# EAGLE design DS18B20_with_DS2480B_MAX233_V3 (EAGLE 7.5.0)
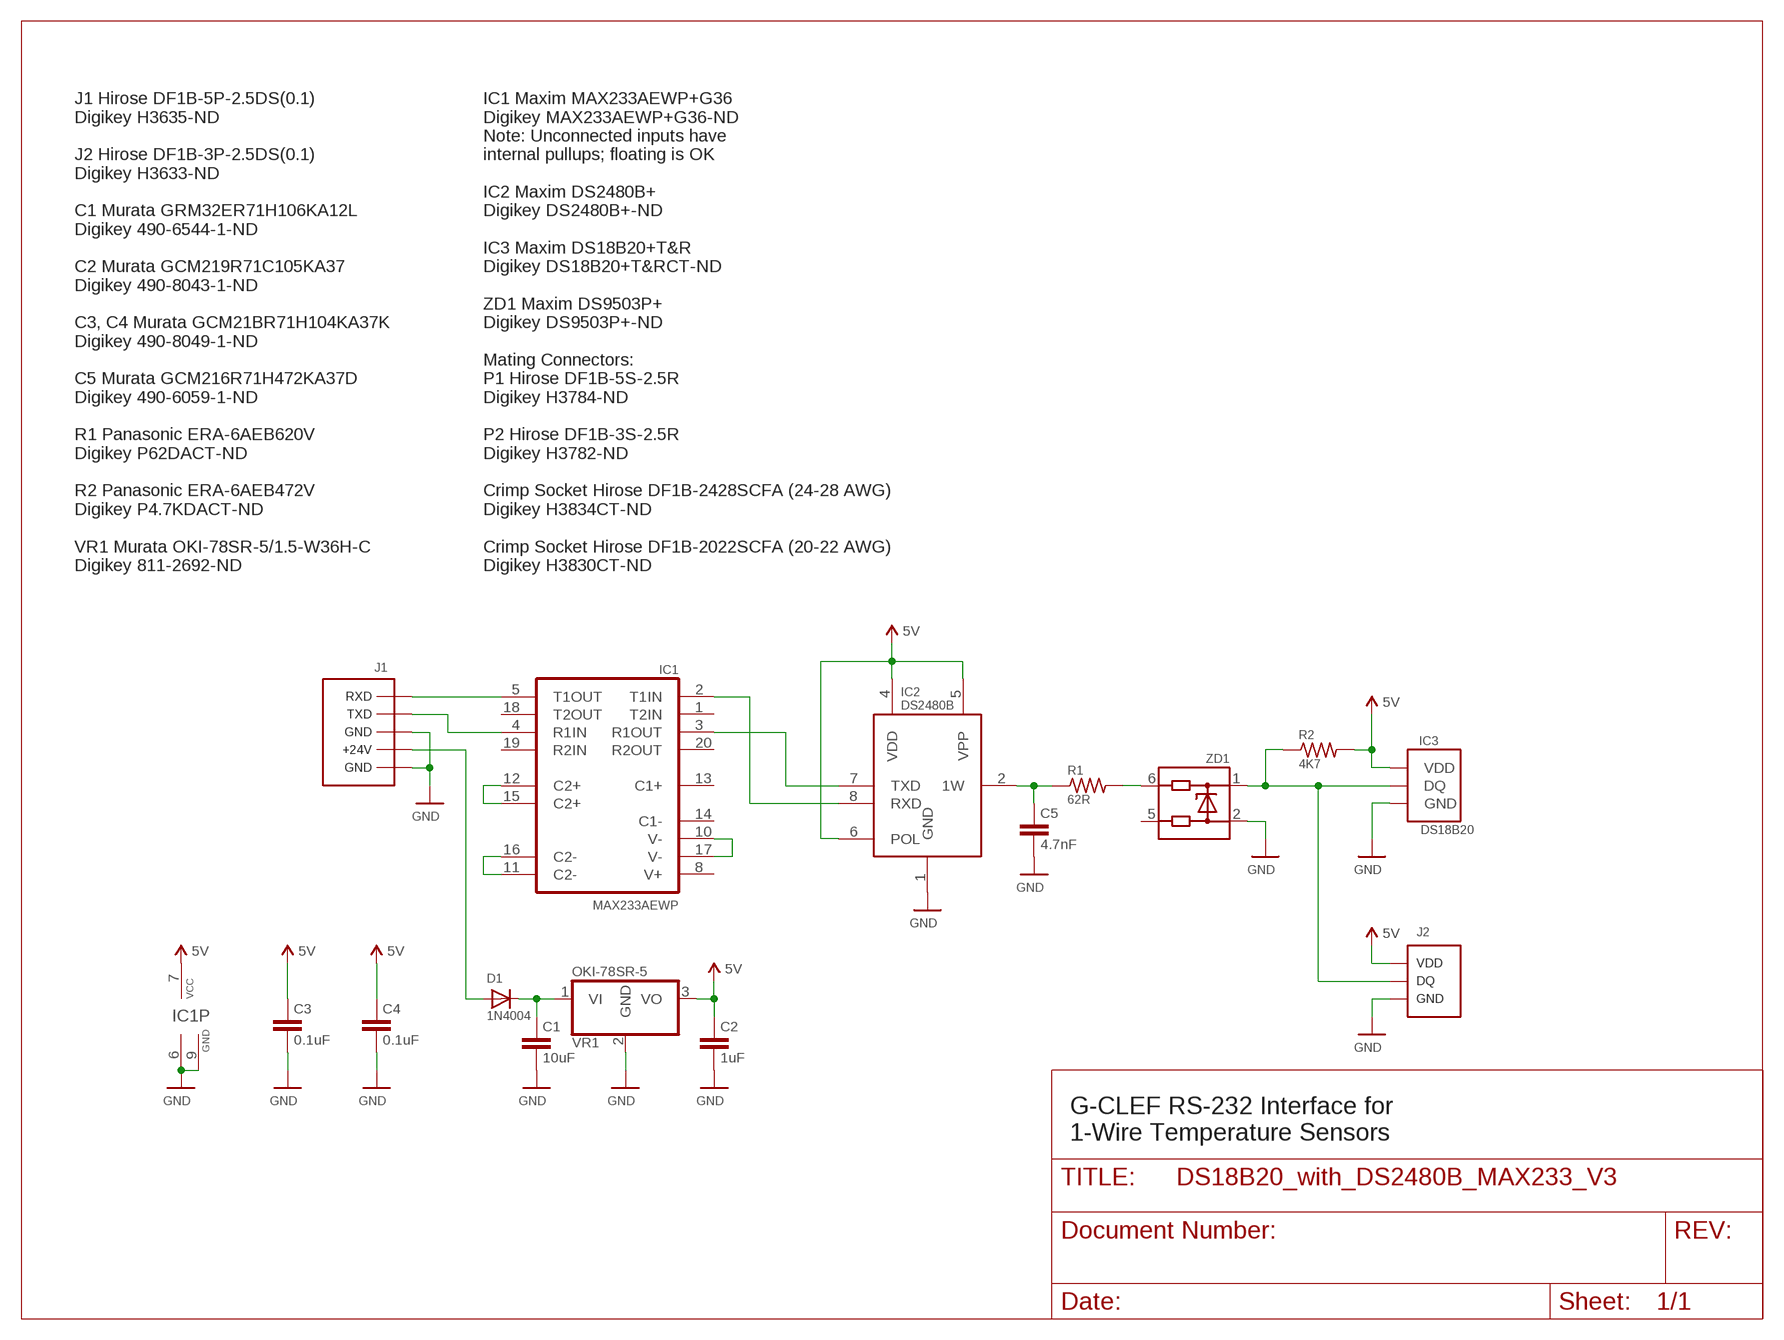
[diagram p0: schematic, sheet 1]

## Parts
C1  10uF  C-UNPOL1210-CAP  [CAPC3225X270N]
C2  1uF  C-UNPOL0805-CAP  [CAPC2013X135N]
C3  0.1uF  C-UNPOL0805-CAP  [CAPC2013X135N]
C4  0.1uF  C-UNPOL0805-CAP  [CAPC2013X135N]
C5  4.7nF  C-UNPOL0805-CAP  [CAPC2013X135N]
D1  1N4004  [DO41-10]
IC1  MAX233AEWP  [SO20L]
IC2  DS2480B  [SO08]
IC3  DS18B20  [TO92-]
J1  DF1B-5P  [DF1B-5P]
J2  DF1B-3P  [DF1B-3P]
R1  62R  RESISTOR-0805  [RESISTOR-0805]
R2  4K7  RESISTOR-0805  [RESISTOR-0805]
VR1  OKI-78SR-5  OKI-78SRH  [OKI-78SR]
ZD1  DS9503P  [TSOC6+]

## Nets
5V: C2.1 C3.1 C4.1 IC1.7(VCC) IC2.4(VDD) IC2.5(VPP) IC2.6(POL) IC3.3(VDD) J2.P$3 R2.2 VR1.3(VO)
GND: C1.2 C2.2 C3.2 C4.2 C5.2 IC1.6(GND) IC1.9(GND) IC2.1(GND) IC3.1(GND) J1.P$1 J1.P$3 J2.P$1 VR1.2(GND) ZD1.2
N$1: D1.A J1.P$2
N$2: C1.1 D1.C VR1.1(VI)
N$3: IC1.2(T1IN) IC2.8(RXD)
N$4: IC1.5(T1OUT) J1.P$5
N$5: IC1.4(R1IN) J1.P$4
N$7: IC1.12(C2+) IC1.15(C2+)
N$8: IC1.11(C2-) IC1.16(C2-)
N$9: IC1.10(V-) IC1.17(V-)
N$10: IC1.3(R1OUT) IC2.7(TXD)
N$11: C5.1 IC2.2(1W) R1.1
N$13: R1.2 ZD1.6
N$14: IC3.2(DQ) J2.P$2 R2.1 ZD1.1
Unconnected: IC1.1(T2IN) IC1.8(V+) IC1.13(C1+) IC1.14(C1-) IC1.18(T2OUT) IC1.19(R2IN) IC1.20(R2OUT) ZD1.5

## Notes on the sheet
- J1 Hirose DF1B-5P-2.5DS(0.1)
  Digikey H3635-ND
  
  J2 Hirose DF1B-3P-2.5DS(0.1)
  Digikey H3633-ND
  
  C1 Murata GRM32ER71H106KA12L
  Digikey 490-6544-1-ND
  
  C2 Murata GCM219R71C105KA37
  Digikey 490-8043-1-ND
  
  C3, C4 Murata GCM21BR71H104KA37K
  Digikey 490-8049-1-ND
  
  C5 Murata GCM216R71H472KA37D
  Digikey 490-6059-1-ND
  
  R1 Panasonic ERA-6AEB620V
  Digikey P62DACT-ND
  
  R2 Panasonic ERA-6AEB472V
  Digikey P4.7KDACT-ND
  
  VR1 Murata OKI-78SR-5/1.5-W36H-C
  Digikey 811-2692-ND
- IC1 Maxim MAX233AEWP+G36
  Digikey MAX233AEWP+G36-ND
  Note: Unconnected inputs have
  internal pullups; floating is OK
  
  IC2 Maxim DS2480B+
  Digikey DS2480B+-ND
  
  IC3 Maxim DS18B20+T&R
  Digikey DS18B20+T&RCT-ND
  
  ZD1 Maxim DS9503P+
  Digikey DS9503P+-ND
  
  Mating Connectors:
  P1 Hirose DF1B-5S-2.5R
  Digikey H3784-ND
  
  P2 Hirose DF1B-3S-2.5R
  Digikey H3782-ND
  
  Crimp Socket Hirose DF1B-2428SCFA (24-28 AWG)
  Digikey H3834CT-ND
  
  Crimp Socket Hirose DF1B-2022SCFA (20-22 AWG)
  Digikey H3830CT-ND
- RXD
- TXD
- GND
- +24V
- GND
- VDD
- DQ
- GND
- G-CLEF RS-232 Interface for
  1-Wire Temperature Sensors

## Library data of the parts
C1-C5 = AU2016:C-UNPOL
D1 = AU2016:1N4004: DIODE General purpose 1N400x type rectifier (With bigger pads) http://www.ladyada.net/library/pcb/eaglelibrary.html
IC1 = AU2016:MAX233AEWP: RS232 TRANSCEIVER; MPN: MAX233AEWP+G36; OC_FARNELL: unknown; OC_NEWARK: 89K3461
IC2 = AU2016:DS2480B: RS232 to 1-Wire Host Adapter/Line Driver with Load Sensor This device is a onewire host and UART interface in one chip. It provides the complete DC/AC requirements for onewire communication, including overdrive speed mode and 12V EPROM programming. On the UART side, it can operate at 9.6kBaud (default), 19.2kBaud, 57.6kBaud, and 115.2kBaud. The RxD and TxD lines are operated at 0V/5V. The POL pin selects the RxD and TxD "polarity", that means straight-through or inverted. If POL is connected to GND, RxD and TxD behave properly for connection to inverted RS232 drivers, like the MC1488/1489 or MAX23x chips. If POL is connected to Vdd, RxD and TxD behave properly for direct connection to a 0V/5V UART chip. Important Notes: RxD and TxD are seen from the UART point of view, that means the DS2480B TxD pin is really an input and the DS2480B RxD pin is really an output. Vpp must be connected to 5V/Vdd if EPROM programming is not required. Vdd must be always lower than or equal to Vpp, otherwise the chip will be damaged. Best idea is to provide a separate 12V->5V/5mA voltage regulator from Vpp to Vdd if EPROM programming is required. Author: Jan Kandziora <jjj@gmx.de>
IC3 = AU2016:DS18B20
J1 = AU2016:DF1B-5P
J2 = AU2016:DF1B-3P
R1 R2 = AU2016:RESISTOR-0805
VR1 = AU2016:OKI-78SR
ZD1 = AU2016:DS9503: ESD Protection Diode with Resistors This ESD protection diode is designed especially for onewire host interfaces. Unlike the DS9502, it has two additional 5Ohm resitors in the 1W and GND line. Pin 5 and 6 have to be connected to the host side, pin 1 und 2 to the network side. The 1W line is through pin 1 and 6, the GND line is through pin 2 and 5. Author: Jan Kandziora <jjj@gmx.de>

## Board
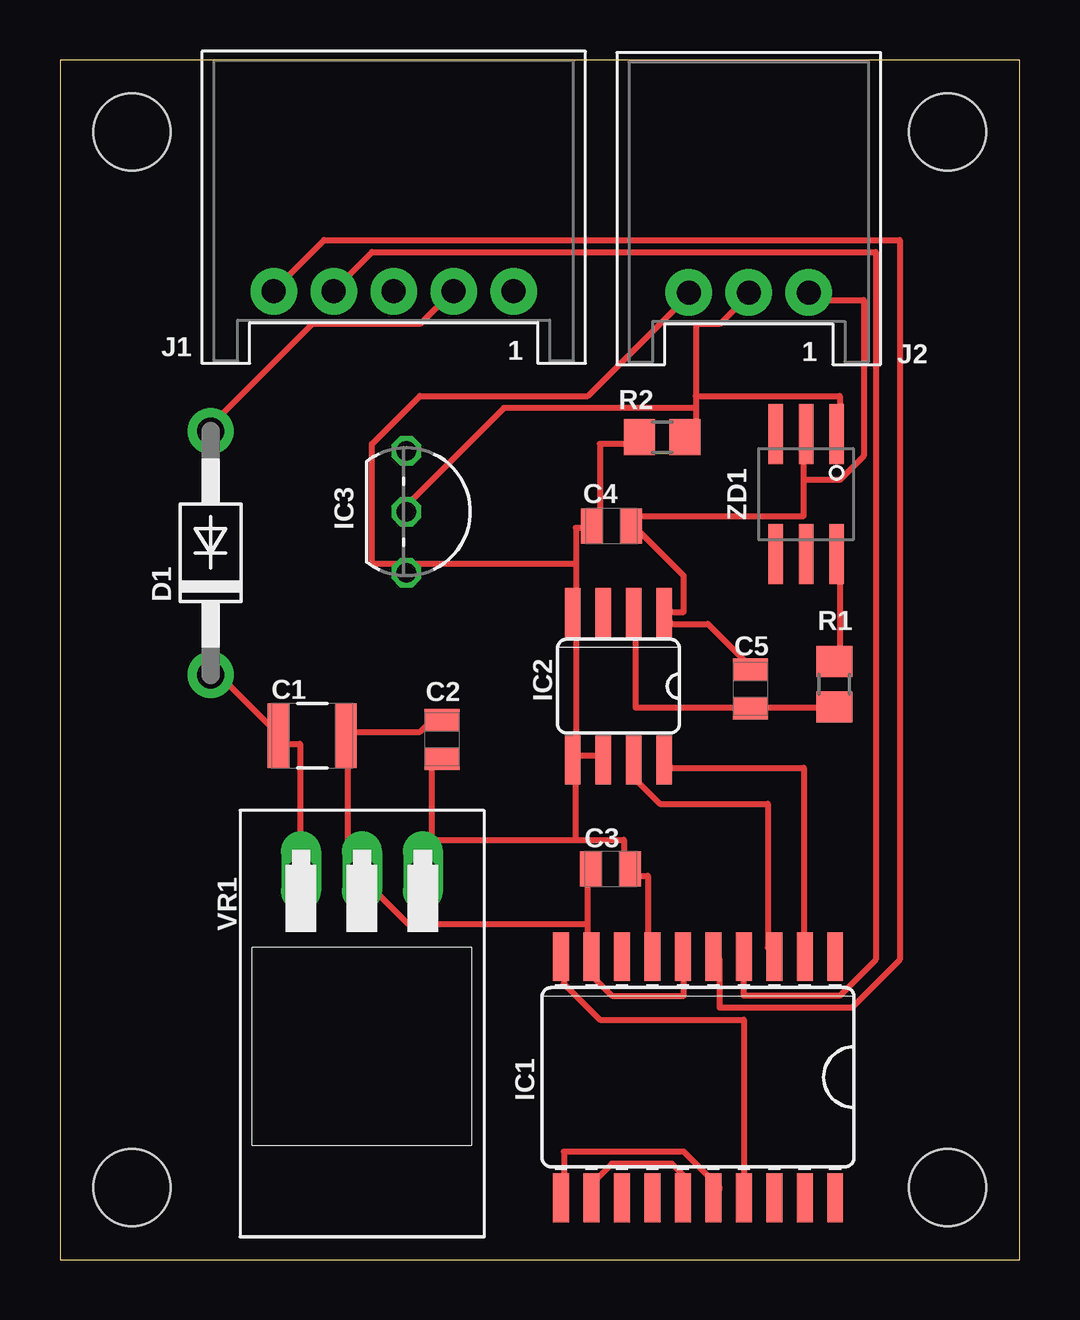
[diagram p1: board, top side]
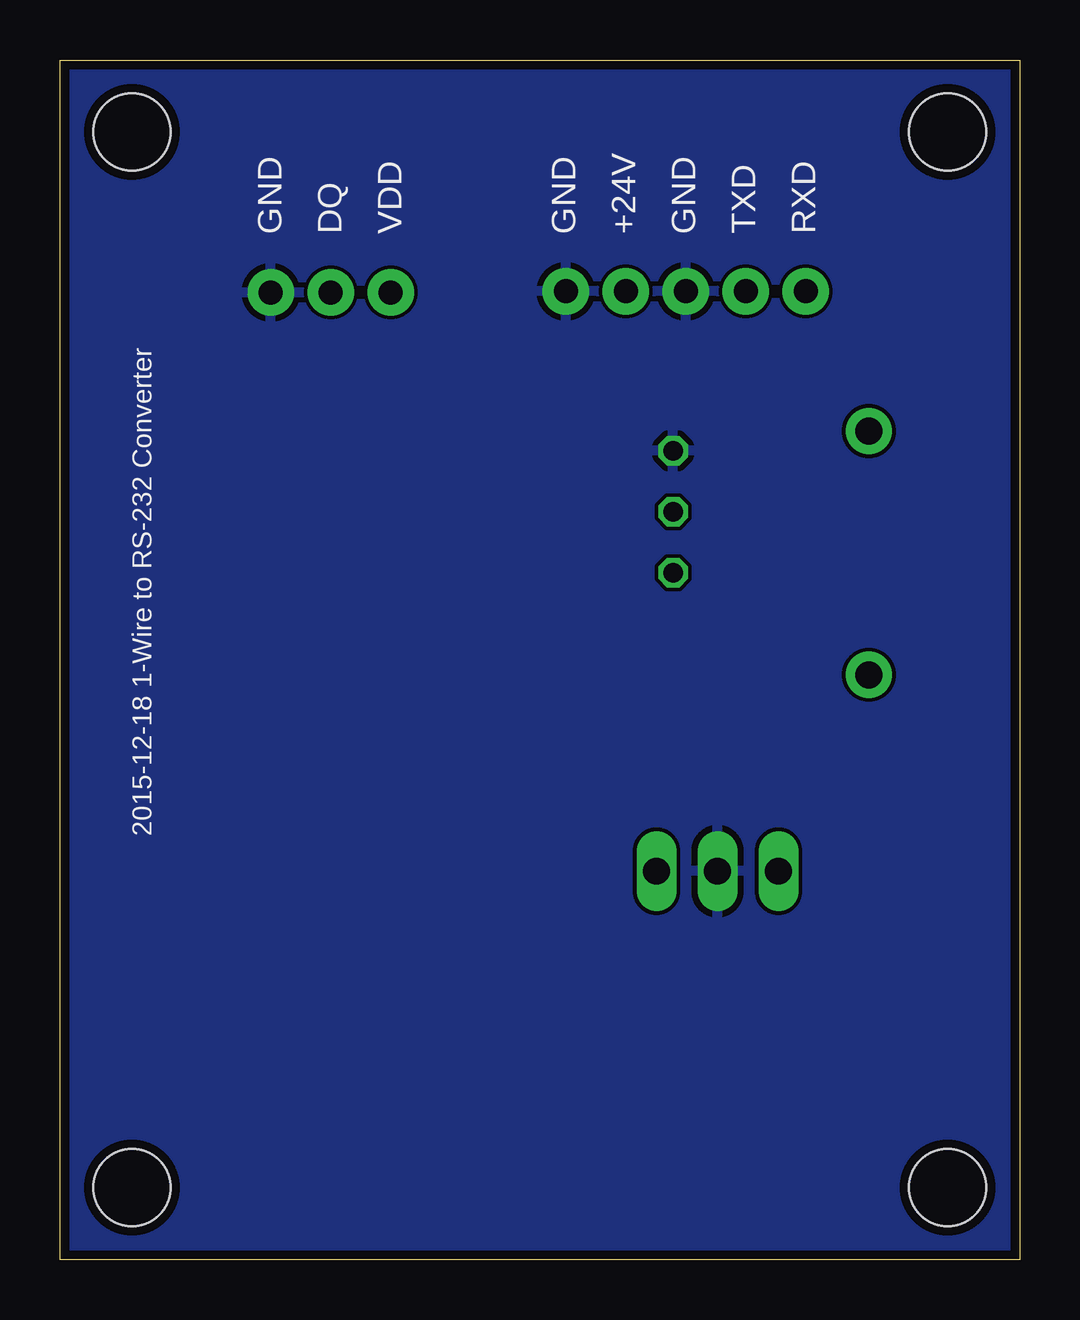
[diagram p2: board, bottom side, seen from below]

Size 40 x 50 mm. Coordinates in mm from the lower left corner, seen from the top.
Outline: 0,0 40,0 40,50 0,50 0,0
Copper layers (1*16): Top 0.0356mm / dielectric 1.5011mm / Bottom 0.0356mm
Design rules "LaenPCBOrder": minimum track width 6mil, minimum drill 13mil, track to track 6mil, track to pad 6mil, pad to pad 6mil, via to via 6mil, smd to smd 6mil, copper to edge 15mil, drill to drill 6mil, minimum pad ring 7mil, minimum via ring 7mil, stop-mask expansion 3mil, vias tented up to drill 0mil, thermal gap 10mil
Holes 3.2 mm at 3,3 3,47 37,47 37,3

### Footprints (pad centres in the part's own frame; a part is rotated, then mirrored left to right if it is on the bottom)
CAPC3225X270N = smd 0.914 x 2.692: 1 -1.397,0; 2 1.397,0
CAPC2013X135N = smd 0.914 x 1.448: 1 -0.813,0; 2 0.813,0
DO41-10 = drill 1.118 pad 1.93: A 5.08,0; C -5.08,0
SO20L = smd 0.66 x 2.032: 1 -5.715,-5.029; 2 -4.445,-5.029; 3 -3.175,-5.029; 4 -1.905,-5.029; 5 -0.635,-5.029; 6 0.635,-5.029; 7 1.905,-5.029; 8 3.175,-5.029; 9 4.445,-5.029; 10 5.715,-5.029; 11 5.715,5.029; 12 4.445,5.029; 13 3.175,5.029; 14 1.905,5.029; 15 0.635,5.029; 16 -0.635,5.029; 17 -1.905,5.029; 18 -3.175,5.029; 19 -4.445,5.029; 20 -5.715,5.029
SO08 = smd 0.66 x 2.032: 1 -1.905,-3.073; 2 -0.635,-3.073; 3 0.635,-3.073; 4 1.905,-3.073; 5 1.905,3.073; 6 0.635,3.073; 7 -0.635,3.073; 8 -1.905,3.073
TO92- = drill 0.813 octagon: 1 -2.54,0; 2 0,0; 3 2.54,0
DF1B-5P = drill 1 pad 1.93: P$1 5,0; P$2 2.5,0; P$3 0,0; P$4 -2.5,0; P$5 -5,0
DF1B-3P = drill 1 pad 1.93: P$1 2.5,-3.81; P$2 0,-3.81; P$3 -2.5,-3.81
RESISTOR-0805 = smd 1.3 x 1.5: 1 -0.95,0; 2 0.95,0
OKI-78SR = drill 1.118 long: 1 2.54,-10.16; 2 0,-10.16; 3 -2.54,-10.16
TSOC6+ = smd 2.5 x 0.6: 1 -2.5,1.28; 2 -2.5,0; 3 -2.5,-1.27; 4 2.5,-1.27; 5 2.5,0; 6 2.5,1.28

### Placement (x,y rotation side)
C1  10.52,21.83 0 top
C2  15.93,21.68 90 top
C3  22.95,16.28 180 top
C4  22.99,30.57 0 top
C5  28.78,23.79 90 top
D1  6.28,29.45 90 top
IC1  26.6,7.6 180 top
IC2  23.28,23.9 180 top
IC3  14.44,31.17 270 top
J1  13.91,40.36 0 top
J2  28.71,44.12 0 top
R1  32.28,23.98 90 top
R2  25.1,34.28 180 top
VR1  12.59,6.03 180 top
ZD1  31.1,31.9 270 top

### Tracks (layer width: path | path; a pad name or v marks a point on that pad's centre or on a via)
5V
  Top 0.254: 21.5,21 22.5,21 IC2.6 | 15.5,17.5 15.5,16.5 VR1.3 15.5,17.5 | 15.5,17.5 15.5,20.5 C2.1 | 15.5,17.5 21.5,17.5 | 21.5,17.5 23.5,17.5 23.5,16.5 C3.1 24,16 24.5,16 24.5,13 IC1.7 | 21.5,17.5 21.5,20.5 IC2.5 21.5,21 | R2.2 24,34 22.5,34 22.5,31 C4.1 22,30.5 21.5,30.5 21.5,29 | 21.5,29 21.5,27 IC2.4 21.5,26.5 21.5,21 | 21.5,29 14.5,29 IC3.3 14,29 13,29 13,34 15,36 22,36 26,40 J2.P$3
GND
  Top 0.254: C5.2 28.5,25 27,26.5 25.5,26.5 IC2.1 25.5,27 26,27 26,28.5 24,30.5 C4.2 24,31 31,31 31,32.5 | 31,32.5 31,34 ZD1.2 | 22,14 22,13 IC1.9 22,12.5 22,12 23,11 26,11 26,12.5 IC1.6 | 22,14 22,16 C3.2 | C2.2 15.5,22.5 15,22 12,22 C1.2 12,21.5 12,16.5 12.5,16.5 VR1.2 12.5,16 14.5,14 22,14 | 31,32.5 32.5,32.5 33.5,33.5 33.5,40 31.5,40 J2.P$1
  pour Bottom: 0,0 40,0 40,55 0,55
N$1
  Top 0.254: D1.A 6.5,35 10.5,39 15,39 16,40 J1.P$2
N$2
  Top 0.254: D1.C 6.5,24 7,24 9,22 C1.1 9.5,21.5 10,21.5 10,16.5 VR1.1
N$3
  Top 0.254: IC1.2 31,13 31,20.5 25.5,20.5 IC2.8
N$4
  Top 0.254: IC1.5 27.5,12.5 27.5,10.5 33,10.5 35,12.5 35,42.5 11,42.5 9,40.5 J1.P$5
N$5
  Top 0.254: IC1.4 28.5,12.5 28.5,11 32.5,11 34,12.5 34,42 13,42 11.5,40.5 J1.P$4
N$7
  Top 0.254: IC1.12 22,3 23,4 25.5,4 26,3.5 26,3 IC1.15
N$8
  Top 0.254: IC1.11 21,3 21,4.5 26,4.5 27.5,3 IC1.16
N$9
  Top 0.254: IC1.17 28.5,3 28.5,10 22.5,10 21,11.5 21,12.5 IC1.10
N$10
  Top 0.254: IC1.3 29.5,13 29.5,19 25,19 24,20 24,20.5 IC2.7
N$11
  Top 0.254: R1.1 32,23 29,23 C5.1 28.5,23 24,23 24,26.5 IC2.2
N$13
  Top 0.254: R1.2 32.5,25 32.5,29 ZD1.6
N$14
  Top 0.254: 26.5,36 26.5,39 27.5,39 28.5,40 J2.P$2 | 26.5,36 26.5,35.5 | 26.5,35.5 26.5,34.5 R2.1 | 26.5,36 32.5,36 32.5,34.5 ZD1.1 | 26.5,35.5 18.5,35.5 14.5,31.5 IC3.2

### Text on the board
bPlace: RXD | TXD | GND | +24V | GND | VDD | DQ | GND | 2015-12-18 1-Wire to RS-232 Converter